# EAGLE design Nearness1u_PCB (EAGLE 9.1.3)
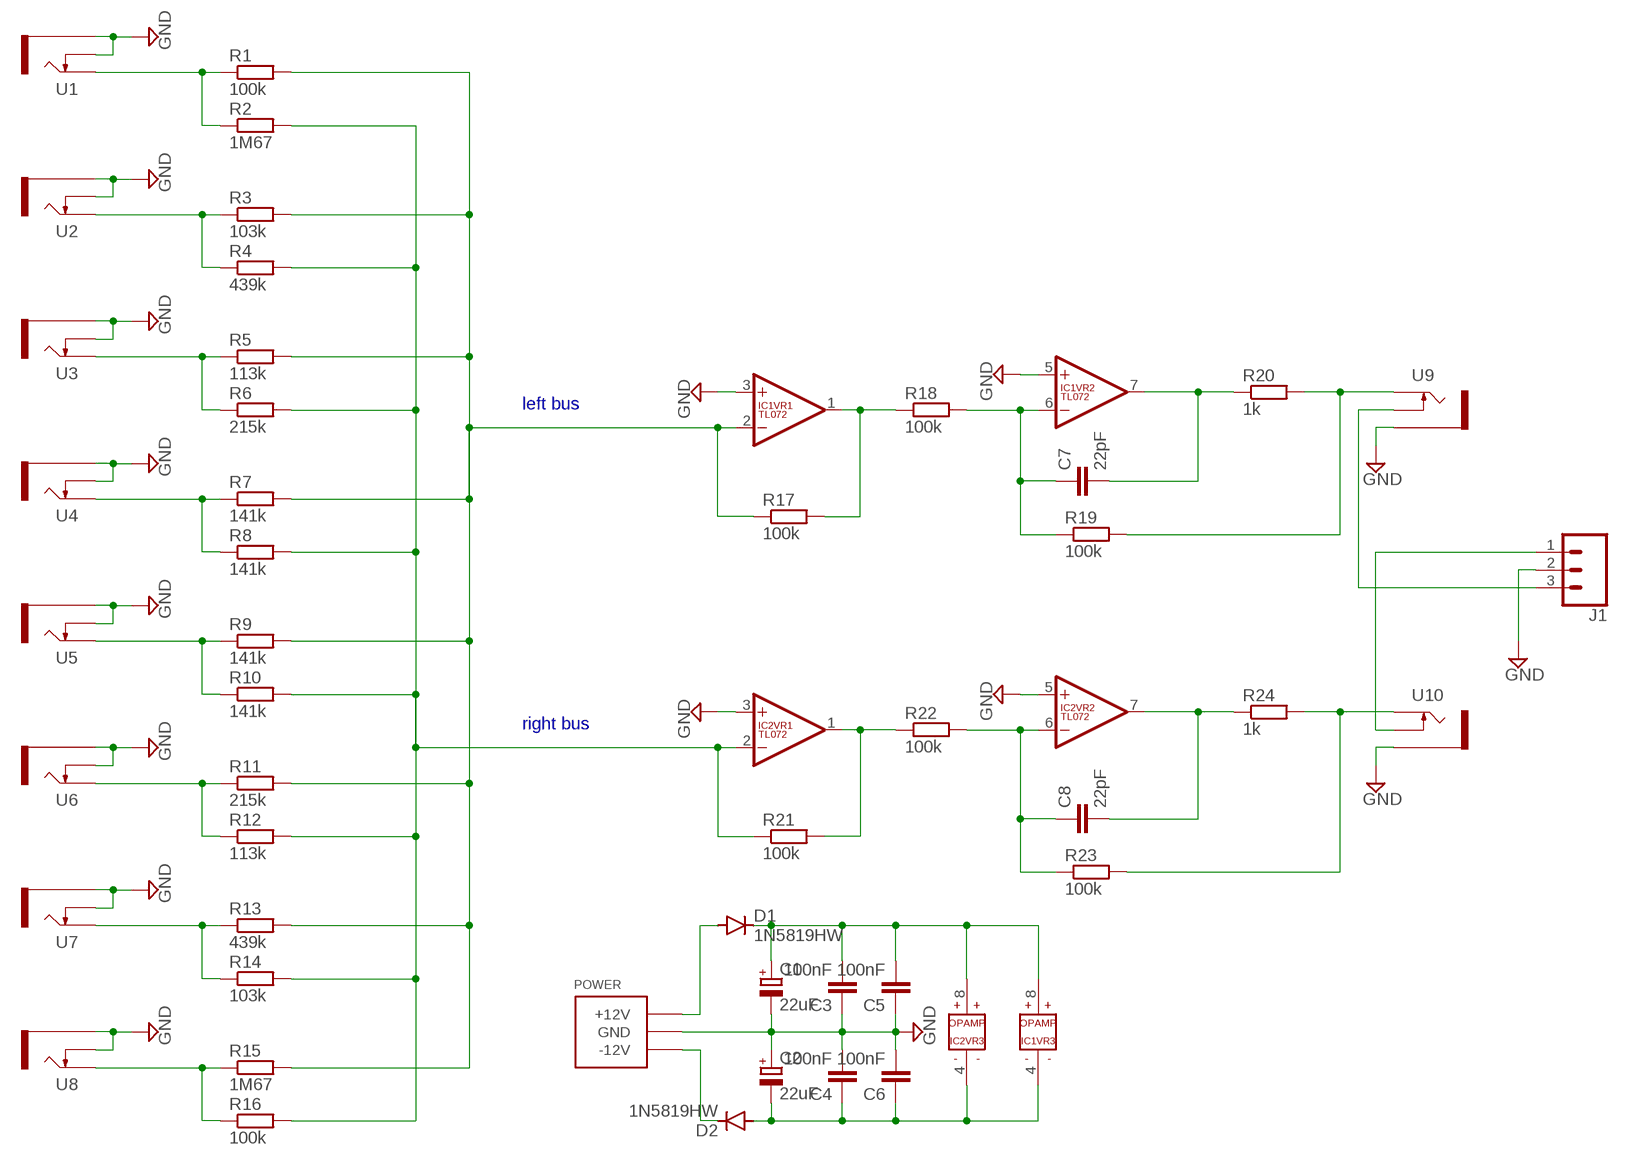
[diagram p0: schematic, sheet 1]

## Parts
C1  22uF  CPOL-EU153CLV-0405  [153CLV-0405]
C2  22uF  CPOL-EU153CLV-0405  [153CLV-0405]
C3  100nF  C-EUC0805  [C0805]
C4  100nF  C-EUC0805  [C0805]
C5  100nF  C-EUC0805  [C0805]
C6  100nF  C-EUC0805  [C0805]
C7  22pF  C-EUC0805  [C0805]
C8  22pF  C-EUC0805  [C0805]
D1  1N5819HW  DIODE-SOD123  [SOD123]
D2  1N5819HW  DIODE-SOD123  [SOD123]
IC1  TL072  [SO08]
IC2  TL072  [SO08]
J1  CONN_03  [1X03]
POWER  POWER_SIMPLE  [2X05_SMT_HEADER]
R1  100k  R-EU_R0805  [R0805]
R2  1M67  R-EU_R0805  [R0805]
R3  103k  R-EU_R0805  [R0805]
R4  439k  R-EU_R0805  [R0805]
R5  113k  R-EU_R0805  [R0805]
R6  215k  R-EU_R0805  [R0805]
R7  141k  R-EU_R0805  [R0805]
R8  141k  R-EU_R0805  [R0805]
R9  141k  R-EU_R0805  [R0805]
R10  141k  R-EU_R0805  [R0805]
R11  215k  R-EU_R0805  [R0805]
R12  113k  R-EU_R0805  [R0805]
R13  439k  R-EU_R0805  [R0805]
R14  103k  R-EU_R0805  [R0805]
R15  1M67  R-EU_R0805  [R0805]
R16  100k  R-EU_R0805  [R0805]
R17  100k  R-EU_R0805  [R0805]
R18  100k  R-EU_R0805  [R0805]
R19  100k  R-EU_R0805  [R0805]
R20  1k  R-EU_R0805  [R0805]
R21  100k  R-EU_R0805  [R0805]
R22  100k  R-EU_R0805  [R0805]
R23  100k  R-EU_R0805  [R0805]
R24  1k  R-EU_R0805  [R0805]
U1  THONKICONNNEW  [WQP-PJ301M-12_JACK]
U2  THONKICONNNEW  [WQP-PJ301M-12_JACK]
U3  THONKICONNNEW  [WQP-PJ301M-12_JACK]
U4  THONKICONNNEW  [WQP-PJ301M-12_JACK]
U5  THONKICONNNEW  [WQP-PJ301M-12_JACK]
U6  THONKICONNNEW  [WQP-PJ301M-12_JACK]
U7  THONKICONNNEW  [WQP-PJ301M-12_JACK]
U8  THONKICONNNEW  [WQP-PJ301M-12_JACK]
U9  THONKICONNNEW  [WQP-PJ301M-12_JACK]
U10  THONKICONNNEW  [WQP-PJ301M-12_JACK]

## Nets
GND: C1.- C2.+ C3.1 C4.2 C5.1 C6.2 IC1.3(VR1:+IN) IC1.5(VR2:+IN) IC2.3(VR1:+IN) IC2.5(VR2:+IN) J1.2 POWER.3(GND) POWER.4(GND) POWER.5(GND) POWER.6(GND) POWER.7(GND) POWER.8(GND) U1.P$2_SWITCH(SWITCH) U1.P$3_SLEEVE(SLEEVE) U2.P$2_SWITCH(SWITCH) U2.P$3_SLEEVE(SLEEVE) U3.P$2_SWITCH(SWITCH) U3.P$3_SLEEVE(SLEEVE) U4.P$2_SWITCH(SWITCH) U4.P$3_SLEEVE(SLEEVE) U5.P$2_SWITCH(SWITCH) U5.P$3_SLEEVE(SLEEVE) U6.P$2_SWITCH(SWITCH) U6.P$3_SLEEVE(SLEEVE) U7.P$2_SWITCH(SWITCH) U7.P$3_SLEEVE(SLEEVE) U8.P$2_SWITCH(SWITCH) U8.P$3_SLEEVE(SLEEVE) U9.P$3_SLEEVE(SLEEVE) U10.P$3_SLEEVE(SLEEVE)
LEFT_BUS: IC1.2(VR1:-IN) R1.2 R3.2 R5.2 R7.2 R9.2 R11.2 R13.2 R15.2 R17.1
N$1: R1.1 R2.1 U1.P$1_TIP(TIP)
N$2: IC2.1(VR1:OUT) R21.2 R22.1
N$3: C8.1 IC2.6(VR2:-IN) R22.2 R23.1
N$4: IC1.1(VR1:OUT) R17.2 R18.1
N$5: R3.1 R4.1 U2.P$1_TIP(TIP)
N$6: C7.1 IC1.6(VR2:-IN) R18.2 R19.1
N$7: C7.2 IC1.7(VR2:OUT) R20.1
N$8: R5.1 R6.1 U3.P$1_TIP(TIP)
N$9: C8.2 IC2.7(VR2:OUT) R24.1
N$10: R19.2 R20.2 U9.P$1_TIP(TIP)
N$11: R7.1 R8.1 U4.P$1_TIP(TIP)
N$12: R23.2 R24.2 U10.P$1_TIP(TIP)
N$14: R9.1 R10.1 U5.P$1_TIP(TIP)
N$15: D1.A POWER.9(+12V) POWER.10(+12V)
N$16: D2.C POWER.1(-12V) POWER.2(-12V)
N$17: R11.1 R12.1 U6.P$1_TIP(TIP)
N$18: J1.3 U9.P$2_SWITCH(SWITCH)
N$20: R13.1 R14.1 U7.P$1_TIP(TIP)
N$21: J1.1 U10.P$2_SWITCH(SWITCH)
N$23: R15.1 R16.1 U8.P$1_TIP(TIP)
RIGHT_BUS: IC2.2(VR1:-IN) R2.2 R4.2 R6.2 R8.2 R10.2 R12.2 R14.2 R16.2 R21.1
V+: C1.+ C3.2 C5.2 D1.C IC1.8(VR3:V+) IC2.8(VR3:V+)
V-: C2.- C4.1 C6.1 D2.A IC1.4(VR3:V-) IC2.4(VR3:V-)

## Notes on the sheet
- left bus
- right bus

## Library data of the parts
C1 C2 = rcl:CPOL-EU: POLARIZED CAPACITOR, European symbol; SPICEPREFIX: C
C3-C8 = rcl:C-EU: CAPACITOR, European symbol; SPICEPREFIX: C
D1 D2 = diode:DIODE-: DIODE
IC1 IC2 = EurorackModularParts:TL072
J1 = SparkFun-Connectors:CONN_03: Multi connection point. Often used as Generic Header-pin footprint for 0.1 inch spaced/style header connections On any of the 0.1 inch spaced packages, you can populate with these: Break Away Headers - Straight <https://www.sparkfun.com/products/116> (PRT-00116) Break Away Male Headers - Right Angle <https://www.sparkfun.com/products/553> (PRT-00553) Female Headers <https://www.sparkfun.com/products/115> (PRT-00115) Break Away Headers - Machine Pin <https://www.sparkfun.com/products/117> (PRT-00117) Break Away Female Headers - Swiss Machine Pin <https://www.sparkfun.com/products/743> (PRT-00743) Stackable Header - 3 Pin (Female, 0.1") <https://www.sparkfun.com/products/13875> (PRT-13875) For SCREWTERMINALS and SPRING TERMINALS visit here: Screw Terimnals on SparkFun.com <https://www.sparkfun.com/search/results?term=Screw+Terminals> (5mm/3.5mm/2.54mm spacing) This device is also useful as a general connection point to wire up your design to another part of your project. Our various solder wires solder well into these plated through hole pads. Hook-Up Wire - Assortment (Stranded, 22 AWG) <https://www.sparkfun.com/products/11375> (PRT-11375) Hook-Up Wire - Assortment (Solid Core, 22 AWG) <https://www.sparkfun.com/products/11367> (PRT-11367) View the entire wire category on our website here <https://www.sparkfun.com/categories/141> Special notes: Molex polarized connector foot print use with SKU : PRT-08232 with associated crimp pins and housings.
POWER = EurorackModularParts:POWER_SIMPLE
R1-R24 = resistor:R-EU_: RESISTOR, European symbol
U1-U10 = MusicThingModular:THONKICONN: 3.5mm socket for Eurorack modular synths

## Board
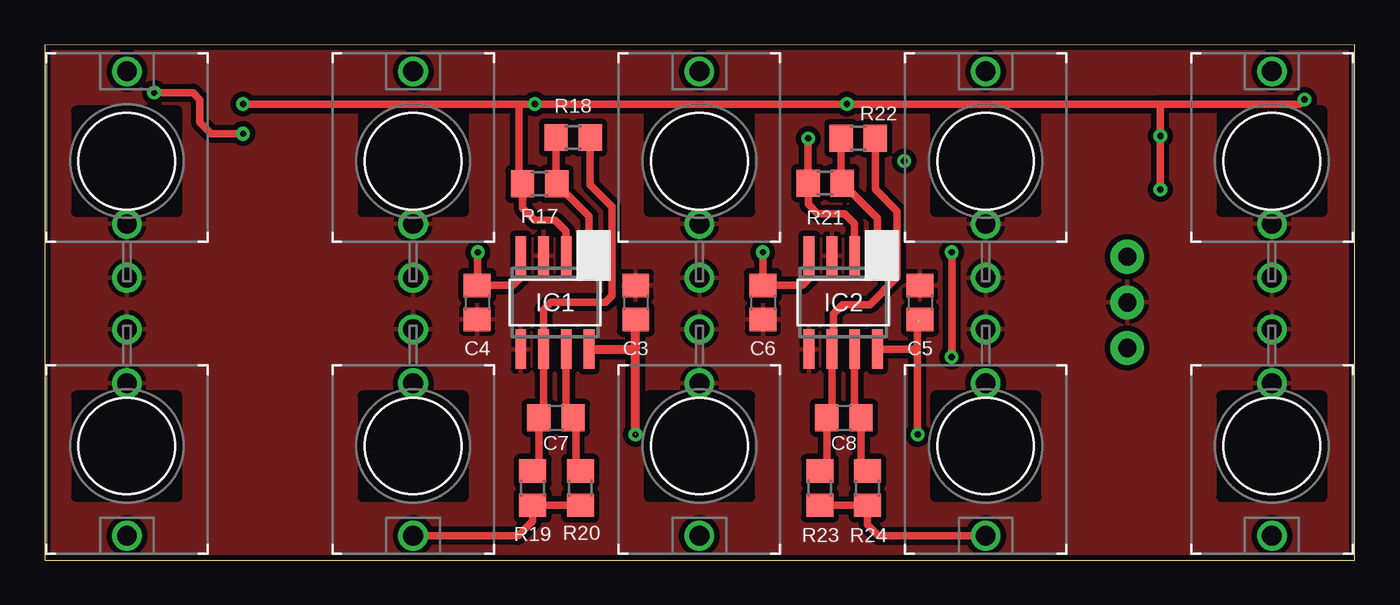
[diagram p1: board, top side]
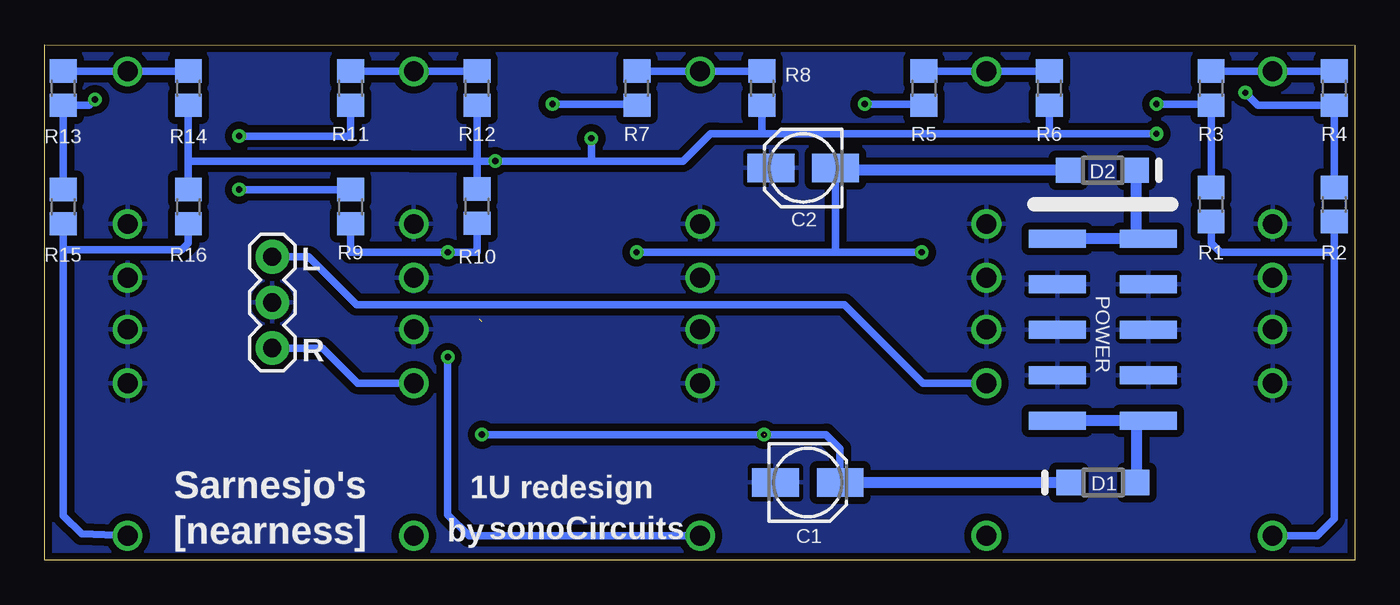
[diagram p2: board, bottom side, seen from below]

Size 73 x 28.7 mm. Coordinates in mm from the lower left corner, seen from the top.
Outline: 0,0 73,0 73,28.7 0,28.69 0,0
Copper layers (1*16): Top 0.035mm / dielectric 1.5mm / Bottom 0.035mm
Design rules "default *": minimum track width 6mil, minimum drill 0.35mm, track to track 6mil, track to pad 6mil, pad to pad 6mil, via to via 6mil, smd to smd 6mil, copper to edge 10mil, drill to drill 6mil, minimum pad ring 10mil, minimum via ring 8mil, stop-mask expansion 4mil, vias tented up to drill 0mil, thermal gap 10mil

### Footprints (pad centres in the part's own frame; a part is rotated, then mirrored left to right if it is on the bottom)
153CLV-0405 = smd 2.6 x 1.6: + 1.8,0; - -1.8,0
C0805 = smd 1.3 x 1.5: 1 -0.95,0; 2 0.95,0
SOD123 = smd 1.4 x 1.4: A 1.9,0; C -1.9,0
SO08 = smd 0.6 x 2.2: 1 -1.905,-2.6; 2 -0.635,-2.6; 3 0.635,-2.6; 4 1.905,-2.6; 5 1.905,2.6; 6 0.635,2.6; 7 -0.635,2.6; 8 -1.905,2.6
1X03 = drill 1.016 pad 1.88: 1 0,0; 2 2.54,0; 3 5.08,0
2X05_SMT_HEADER = smd 1 x 3.17: 1 -5.08,-2.54; 2 -5.08,2.54; 3 -2.54,-2.54; 4 -2.54,2.54; 5 0,-2.54; 6 0,2.54; 7 2.54,-2.54; 8 2.54,2.54; 9 5.08,-2.54; 10 5.08,2.54
R0805 = smd 1.3 x 1.5: 1 -0.95,0; 2 0.95,0
WQP-PJ301M-12_JACK = drill 1.1: P$1_TIP 0,5; P$2_SWITCH 0,-3.5; P$3_SLEEVE 0,-6.5

### Placement (x,y rotation side)
C1  30.48,4.32 0 bottom
C2  30.73,21.84 180 bottom
C3  32.93,14.35 270 top
C4  24.1,14.35 270 top
C5  48.78,14.35 270 top
C6  40.02,14.35 270 top
C7  28.49,7.93 0 top
C8  44.53,7.93 0 top
D1  14.03,4.32 0 bottom
D2  14.06,21.72 180 bottom
IC1  28.43,14.35 180 top
IC2  44.5,14.35 180 top
J1  60.33,11.81 90 bottom
POWER  14.03,12.83 270 bottom
R1  8,19.81 90 bottom
R2  1.14,19.81 90 bottom
R3  8,26.29 270 bottom
R4  1.14,26.29 270 bottom
R5  24,26.29 270 bottom
R6  17.02,26.29 270 bottom
R7  40.01,26.29 270 bottom
R8  33.02,26.29 270 bottom
R9  55.96,19.68 90 bottom
R10  48.91,19.71 90 bottom
R11  55.96,26.29 270 bottom
R12  48.91,26.29 270 bottom
R13  71.98,26.29 270 bottom
R14  65,26.29 270 bottom
R15  71.98,19.68 90 bottom
R16  65,19.68 90 bottom
R17  27.58,20.96 0 top
R18  29.44,23.54 0 top
R19  27.19,4 270 top
R20  29.85,4 270 top
R21  43.49,21 0 top
R22  45.33,23.5 0 top
R23  43.19,4 270 top
R24  45.85,4 270 top
U1  4.57,6.35 180 top
U2  4.57,22.23 0 top
U3  20.53,22.23 0 top
U4  36.48,22.23 0 top
U5  36.48,6.35 180 top
U6  52.43,22.23 0 top
U7  68.39,22.23 0 top
U8  68.39,6.35 180 top
U9  20.53,6.35 180 top
U10  52.43,6.35 180 top

### Tracks (layer width: path | path; a pad name or v marks a point on that pad's centre or on a via)
GND
  pour Top (isolate 0.305): 0,0.1 72.9,0.1 72.9,28.7 0,28.7
  pour Bottom (isolate 0.406): 0,0 0.2,0 73,0 73,28.6 0,28.6
LEFT_BUS  (via drill 0.35)
  Top 0.406: v62.17,20.64 v62.17,23.62 62.17,25.4 | 62.17,25.4 69.95,25.4 v70.2,25.65 | 62.17,25.4 v44.7,25.4 v27.31,25.4 26.42,25.4 | v11.05,25.4 26.42,25.4 | 26.42,25.4 26.42,21.17 R17.1 26.63,19.6 27.3,18.92 28.45,18.92 29.06,18.31 IC1.2
  Bottom 0.406: R15.2 R13.2 70.52,25.34 v70.2,25.65 | R9.2 v62.17,20.64 | R11.2 55.96,23.62 v62.17,23.62 | R1.2 R3.2 8.06,25.4 v11.05,25.4 | v27.31,25.4 24.07,25.4 R5.2 | v44.7,25.4 40.07,25.4 R7.2
N$1
  Bottom 0.406: R2.1 1.14,17.14 | 1.14,17.14 1.14,2.29 2.08,1.35 U1.P$1_TIP | R1.1 8,17.65 7.49,17.14 1.14,17.14
N$2
  Top 0.406: R22.1 44.38,21.06 R21.2 46.4,19.04 IC2.1
N$3
  Top 0.406: R22.2 46.28,20.65 47.5,19.43 47.5,15.75 45.97,14.22 44.45,14.22 43.94,13.72 43.94,11.83 IC2.6 43.86,8.21 C8.1 43.58,5.34 R23.1
N$4
  Top 0.406: R18.1 28.49,21 R17.2 30.33,19.15 IC1.1
N$5
  Bottom 0.406: R3.1 7.99,27.23 U2.P$1_TIP 1.16,27.23 R4.1
N$6
  Top 0.406: R19.1 27.54,5.3 C7.1 27.79,8.18 IC1.6 27.79,13.95 28.07,14.22 28.19,14.35 31.24,14.35 31.62,14.73 31.62,19.68 30.39,20.92 R18.2
N$7
  Top 0.406: IC1.7 29.06,8.3 C7.2 29.6,7.76 | R20.1 29.6,5.19 29.6,6.99 | 29.6,7.76 29.6,7.63 29.6,6.99 | 29.6,7.76 29.6,6.99
N$8
  Bottom 0.406: 20.58,27.24 21.83,27.24 R5.1 | 20.58,27.24 U3.P$1_TIP | R6.1 20.58,27.24
N$9
  Top 0.406: IC2.7 45.13,8.12 45.4,7.85 C8.2 45.48,5.32 R24.1
N$10
  Top 0.406: R20.2 R19.2 27.19,2.17 26.37,1.35 U9.P$1_TIP
N$11
  Bottom 0.406: R7.1 39.99,27.23 U4.P$1_TIP 33.03,27.23 R8.1
N$12
  Top 0.406: R23.2 R24.2 45.85,1.97 46.47,1.35 U10.P$1_TIP
N$14  (via drill 0.35)
  Top 0.406: v50.55,11.3 v50.55,17.14
  Bottom 0.406: U5.P$1_TIP 49.37,1.35 50.55,2.53 v50.55,11.3 | R9.1 55.96,17.14 v50.55,17.14 48.91,17.14 R10.1
N$15
  Bottom 0.61: 11.73,7.75 12.13,7.75 D1.A | 11.73,7.75 POWER.9 | POWER.10 11.73,7.75
N$16
  Bottom 0.406: 12.15,17.91 POWER.2 12.95,17.91
  Bottom 0.61: 12.95,17.91 POWER.1 | 12.15,17.91 D2.C
N$17
  Bottom 0.406: R11.1 52.4,27.24 U6.P$1_TIP 48.92,27.23 R12.1
N$18
  Bottom 0.406: U9.P$2_SWITCH 24.07,9.85 28.45,14.22 55.63,14.22 58.29,16.89 J1.3
N$20
  Bottom 0.406: R13.1 71.97,27.23 U7.P$1_TIP 65.01,27.23 R14.1
N$21
  Bottom 0.406: U10.P$2_SWITCH 55.57,9.85 57.53,11.81 J1.1
N$23
  Bottom 0.406: U8.P$1_TIP 70.95,1.45 71.98,2.48 71.98,17.27 | R15.1 71.98,17.27 | R16.1 65,17.65 65.38,17.27 71.98,17.27
RIGHT_BUS  (via drill 0.35)
  Top 0.406: v6.1,26.04 8.26,26.04 8.64,25.65 8.64,24.38 9.27,23.75 v11.05,23.75 | IC2.2 45.13,18.75 44.58,19.3 43.05,19.3 42.55,19.81 R21.1 v42.54,23.49 v42.55,23.5
  Bottom 0.406: R14.2 65,22.23 | 65,22.23 R16.2 | 48.91,22.23 52.71,22.23 65,22.23 | R12.2 48.91,22.23 | 48.91,22.23 R10.2 | R2.2 R4.2 5.4,25.34 v6.1,26.04 | R8.2 33.02,23.75 | 33.02,23.75 35.56,23.75 35.91,23.75 37.44,22.23 42.55,22.23 | 17.02,23.75 18.42,23.75 33.02,23.75 | R6.2 17.02,23.75 | 48.91,22.23 v47.9,22.23 42.55,22.23 | v42.55,23.5 42.55,22.23 | 17.02,23.75 v11.05,23.75
V+  (via drill 0.35)  (2 unrouted)
  Top 0.406: v48.64,6.99 48.64,11.68 | 48.64,11.68 48.64,13.26 | IC2.8 48.58,11.75 48.64,11.68 | v32.92,6.98 32.93,7
  Top 0.508: IC1.8 32.83,11.75 32.93,11.85 | 32.93,11.85 C3.2 | 32.93,7 32.93,11.85
  Bottom 0.406: C1.+ 28.68,6.2 29.46,6.99 v32.92,6.99 v32.92,6.98 | v48.64,6.99 32.89,6.99 32.89,6.98
  Bottom 0.61: D1.C C1.+
V-  (via drill 0.35)
  Top 0.406: IC2.4 42.59,15.84 42.59,15.81 42.59,15.67 42.22,15.3 C6.1 v40.02,17.14 | v24.13,17.14 24.13,15.33 C4.1 26.09,15.3 26.54,15.75 26.52,15.77 IC1.4
  Bottom 0.406: v40.02,17.14 28.96,17.14 | 28.96,17.14 v24.13,17.14 | C2.- 28.93,17.17 28.96,17.14
  Bottom 0.61: D2.A 28.93,21.72 C2.-

### Text on the board
bNames: L | R | 1U redesign | Sarnesjo's | sonoCircuits | by | [nearness]